# Altium schematic sheet MPU6050EVM.SchDoc
size A4
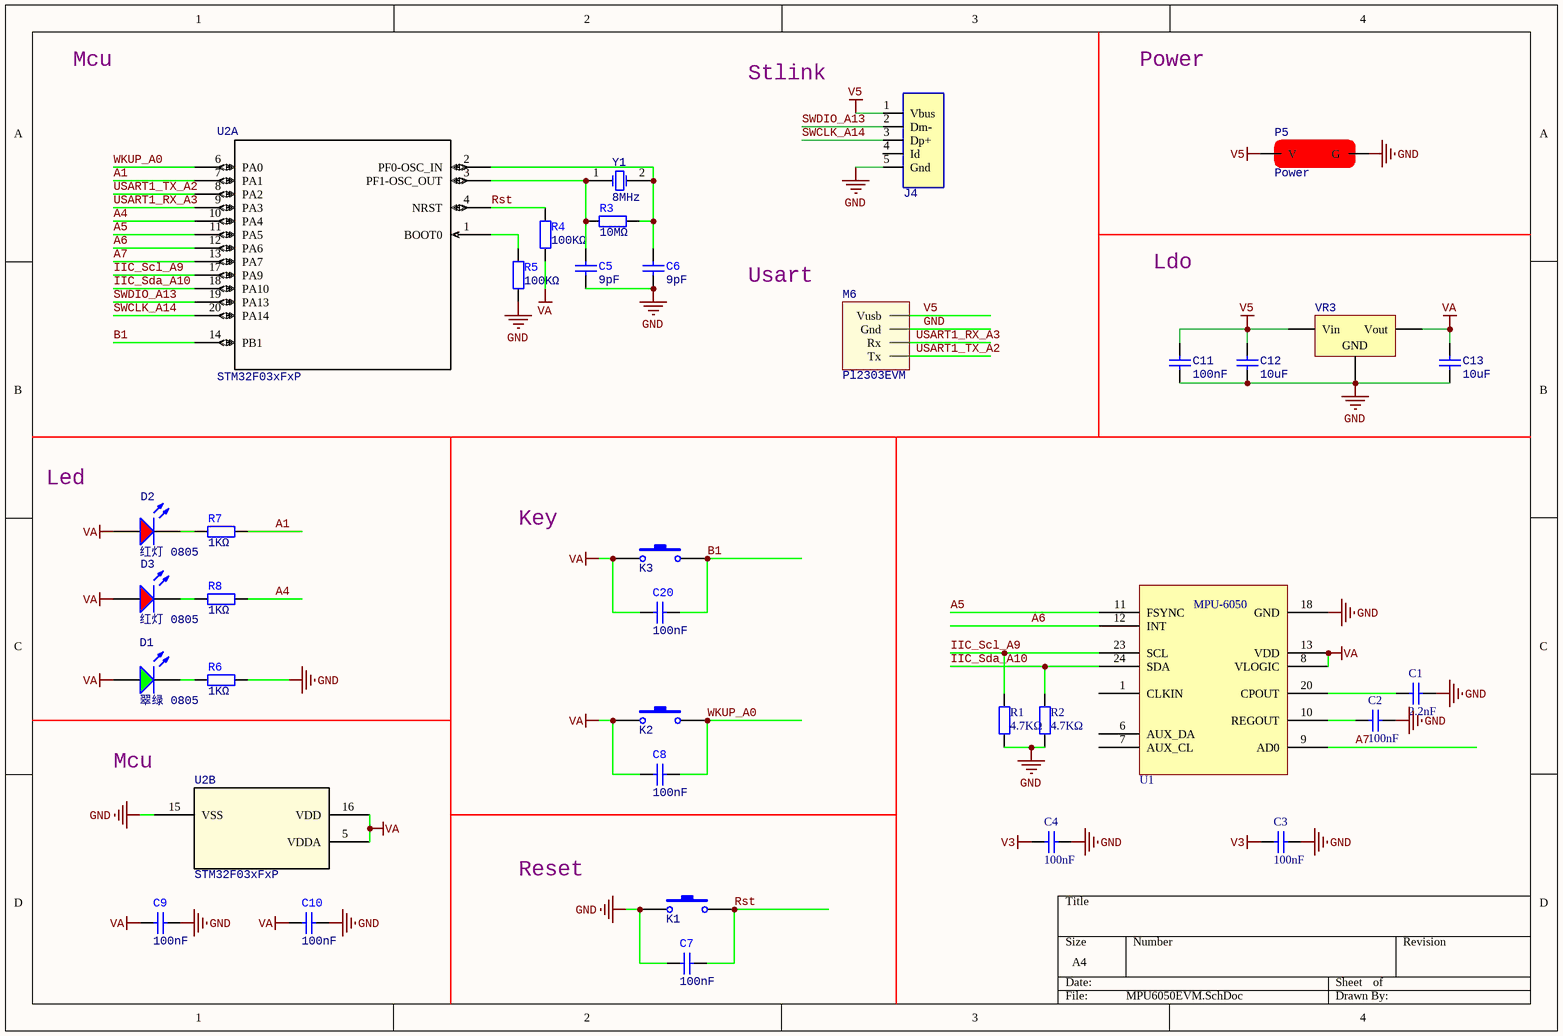
[diagram p0: MPU6050EVM.SchDoc]

## Parts
C1  2.2nF  [0805_C]
C2  100nF  [0805_C]
C3  100nF  [0805_C]
C4  100nF  [0805_C]
C5  9pF  [0805_C]
C6  9pF  [0805_C]
C7  100nF  [0805_C]
C8  100nF  [0805_C]
C9  100nF  [0805_C]
C10  100nF  [0805_C]
C11  100nF  [0805_C]
C12  10uF  [0805_C]
C13  10uF  [0805_C]
C20  100nF  [0805_C]
D1  翠绿 0805  [0805_LED_S1]
D2  红灯 0805  [0805_LED_S1]
D3  红灯 0805  [0805_LED_S1]
J4  UsbOtg  [USB-MINI-A]  (value not drawn)
K1  SW  [SWITCH]  (value not drawn)
K2  SW  [SWITCH]  (value not drawn)
K3  SW  [SWITCH]  (value not drawn)
M6  Pl2303EVM  [PI230203EVM]
P5  Power  [DC-005]
R1  4.7KΩ  [0805_R]
R2  4.7KΩ  [0805_R]
R3  10MΩ  [0805_R]
R4  100KΩ  [0805_R]
R5  100KΩ  [0805_R]
R6  1KΩ  [0805_R]
R7  1KΩ  [0805_R]
R8  1KΩ  [0805_R]
U1  MPU6050  [QFN24 4x4_L]  (value not drawn)
U2  STM32F03xFxP  [TSSOP20]  (parts A,B of 2)
VR3  AMS1117-3.3  [SOT-223]  (value not drawn)
Y1  8MHz  [XTAL_US]

## Nets
GND: C1.2 C2.1 C3.2 C4.2 C5.1 C6.1 C7.2 C9.1 C10.1 C11.1 C12.1 C13.1 J4.5(Gnd) K1.1 M6.2(Gnd) P5.2(G) R1.1 R2.1 R5.1 R6.1 U1.18(GND) U2.15(VSS) VR3.1(GND)
V3: C3.1 C4.1
V5: C11.2 C12.2 J4.1(Vbus) M6.1(Vusb) P5.1(V) VR3.3(Vin)
VA: C8.2 C9.2 C10.2 C13.2 C20.2 D1.A D2.A D3.A K2.1 K3.1 R4.1 U1.8(VLOGIC) U1.13(VDD) U2.5(VDDA) U2.16(VDD) VR3.2(Vout)
A1: R7.1 U2.7(PA1)
A4: R8.1 U2.10(PA4)
A5: U1.11(FSYNC) U2.11(PA5)
A6: U1.12(INT) U2.12(PA6)
A7: U1.9(AD0) U2.13(PA7)
B1: C20.1 K3.2 U2.14(PB1)
IIC_Scl_A9: R1.2 U1.23(SCL) U2.17(PA9)
IIC_Sda_A10: R2.2 U1.24(SDA) U2.18(PA10)
Rst: C7.1 K1.2 R4.2 U2.4(NRST)
SWCLK_A14: J4.3(Dp+) U2.20(PA14)
SWDIO_A13: J4.2(Dm-) U2.19(PA13)
USART1_RX_A3: M6.3(Rx) U2.9(PA3)
USART1_TX_A2: M6.4(Tx) U2.8(PA2)
WKUP_A0: C8.1 K2.2 U2.6(PA0)
NetC1_1: C1.1 U1.20(CPOUT)
NetC2_2: C2.2 U1.10(REGOUT)
NetC5_2: C5.2 R3.1 U2.3(PF1-OSC_OUT) Y1.1(OSC1)
NetC6_2: C6.2 R3.2 U2.2(PF0-OSC_IN) Y1.2(OSC2)
NetD1_K: D1.K R6.2
NetD2_K: D2.K R7.2
NetD3_K: D3.K R8.2
NetR5_2: R5.2 U2.1(BOOT0)

Not connected (* = marked no-connect by the designer): J4 4(Id); U1 1(CLKIN) 6(AUX_DA) 7(AUX_CL)

## Notes on the sheet
- Mcu
- Stlink
- Power
- Usart
- Ldo
- Led
- Key
- Reset
- (in symbol MPU6050) MPU-6050

## Library data of the parts
C1-C4 = 0805 2.2nF (222) 5% 50V: 贴片电容; ComponentLink1Description: 供应商链接; ComponentLink1URL: http://www.szlcsc.com/product/details_29010.html; Package: 0805; Supplier: LC; SuppliersPartNumber: C28260
C5-C10 C20 = 0805 10nF (103) 10% 50V: 贴片电容; ComponentLink1Description: 供应商链接; ComponentLink1URL: http://www.szlcsc.com/product/details_2062.html; Package: 0805; Supplier: LC; SuppliersPartNumber: C1710
C11-C13 = 0805 10uF (106) 10% 25V: 贴片电容; ComponentLink1Description: 供应商链接; ComponentLink1URL: http://www.szlcsc.com/product/details_16532.html; Package: 0805; Supplier: LC; SuppliersPartNumber: C15850
D1 = 0805 翠绿: 发光二极管; ComponentLink1Description: 供应商链接; ComponentLink1URL: http://www.szlcsc.com/product/details_2670.html; Package: 0805; Supplier: LC; SuppliersPartNumber: C2297
D2 D3 = 0805 红灯: 发光二极管; ComponentLink1Description: 供应商链接; ComponentLink1URL: http://www.szlcsc.com/product/details_2668.html; Package: 0805; Supplier: LC; SuppliersPartNumber: C2295
K1-K3 = SW: Switch
R1 R2 = 0805 4.7KΩ (4701) 1%: 贴片电阻; ComponentLink1Description: 供应商链接; ComponentLink1URL: http://www.szlcsc.com/product/details_18361.html; Package: 0805; Supplier: LC; SuppliersPartNumber: C17673
R3-R8 = 0805 10KΩ (1002) 1%: 贴片电阻; ComponentLink1Description: 供应商链接; ComponentLink1URL: http://www.szlcsc.com/product/details_18102.html; Package: 0805; Supplier: LC; SuppliersPartNumber: C17414
U2 = STM32F03xFxP: Mcu; Vendor: STMicroelectronics; C: Copyright (C) 2016 Accelerated Designs. All rights reserved; Copyright: Copyright (C) 2016 Accelerated Designs. All rights reserved; Manufacturer_Part_Number: stm32f03xfxp; RefDes: RefDes; Type: Type; Value: Value
VR3 = SOT-223 AMS1117-3.3: 低压差线性稳压(LDO); ComponentLink1Description: 供应商链接; ComponentLink1URL: http://www.szlcsc.com/product/details_6652.html; Package: SOT-223; Supplier: LC; SuppliersPartNumber: C6186
Y1 = XTAL: Crystal Oscillator; Published: 8-Jun-2000; LatestRevisionDate: 17-Jul-2002; LatestRevisionNote: Re-released for DXP Platform.; Publisher: Altium Limited